# Altium project dev-board-boost.PrjPcb
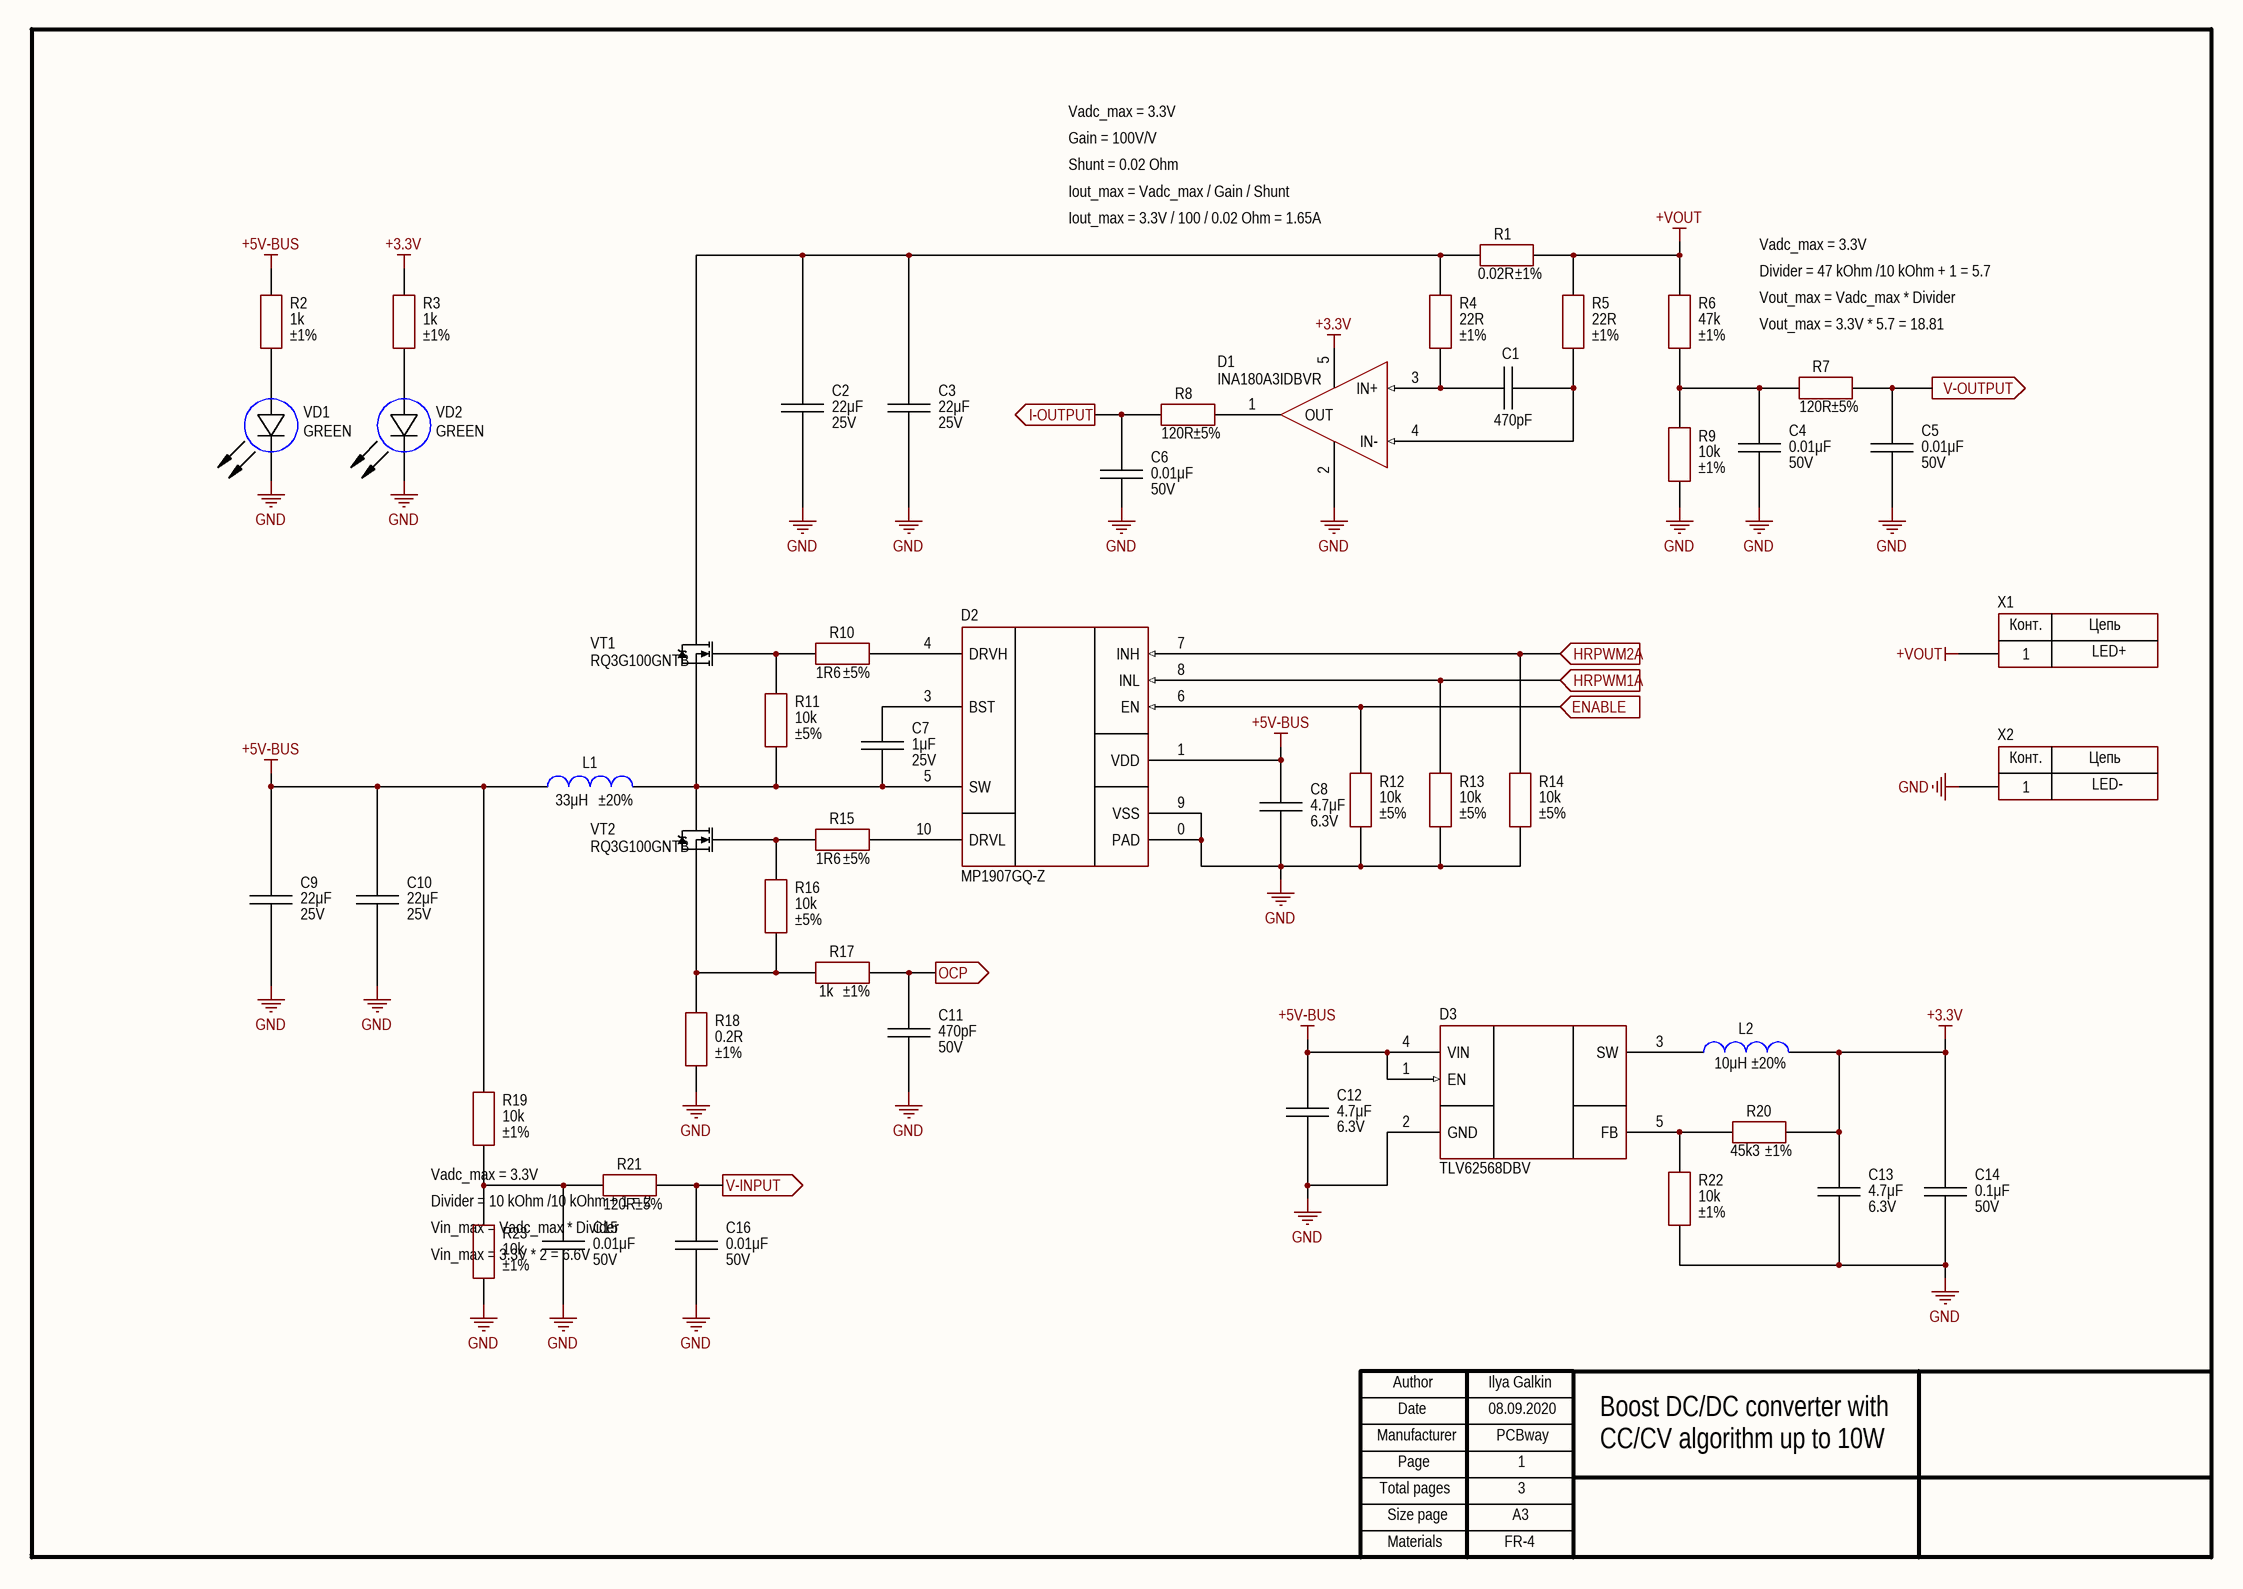
[diagram p0: converter.SchDoc]
3 sheets, 108 parts. Net scope: global (net labels, ports and power ports of the same name join across sheets).
Board file: pcb.PcbDoc
Sheets:
  converter.SchDoc
  dsp.SchDoc
  usb.SchDoc

## Sheet converter.SchDoc
size 420 x 297 mm; Address1: Address1; Address2: Address2; Address3: Address3; Address4: Address4; DocumentNumber: АБВГ.123456.001 Э3; SheetNumber: 1; SheetTotal: 3; Scale: 1:1; DocumentType: Схема электрическая принципиальная; FirstReferrence: АБВГ.123456.001

### Parts
C1  value 470pF  [CAP: 0603]
C2  value 22μF  Voltage: 25V  [CAP: 1210]
C3  value 22μF  Voltage: 25V  [CAP: 1210]
C4  value 0.01μF  Voltage: 50V  [CAP: 0603]
C5  value 0.01μF  Voltage: 50V  [CAP: 0603]
C6  value 0.01μF  Voltage: 50V  [CAP: 0603]
C7  value 1μF  Voltage: 25V  [CAP: 0603]
C8  value 4.7μF  Voltage: 6.3V  [CAP: 0603]
C9  value 22μF  Voltage: 25V  [CAP: 1210]
C10  value 22μF  Voltage: 25V  [CAP: 1210]
C11  value 470pF  Voltage: 50V  [CAP: 0603]
C12  value 4.7μF  Voltage: 6.3V  [CAP: 0603]
C13  value 4.7μF  Voltage: 6.3V  [CAP: 0603]
C14  value 0.1μF  Voltage: 50V  [CAP: 0603]
C15  value 0.01μF  Voltage: 50V  [CAP: 0603]
C16  value 0.01μF  Voltage: 50V  [CAP: 0603]
D1  (no value)  [SOT23-5]
D2  (no value)  [10-DFN]
D3  (no value)  [SOT23-5]
L1  value 33μH  Tolerance: ±20%  [IND: SRP1038C]
L2  value 10μH  Tolerance: ±20%  [IND: CD32]
R1  value 0.02R  Tolerance: ±1%  [RES: 1206]
R2  value 1k  Tolerance: ±1%  [RES: 0603]
R3  value 1k  Tolerance: ±1%  [RES: 0603]
R4  value 22R  Tolerance: ±1%  [RES: 0603]
R5  value 22R  Tolerance: ±1%  [RES: 0603]
R6  value 47k  Tolerance: ±1%  [RES: 0603]
R7  value 120R  Tolerance: ±5%  [RES: 0603]
R8  value 120R  Tolerance: ±5%  [RES: 0603]
R9  value 10k  Tolerance: ±1%  [RES: 0603]
R10  value 1R6  Tolerance: ±5%  [RES: 0603]
R11  value 10k  Tolerance: ±5%  [RES: 0603]
R12  value 10k  Tolerance: ±5%  [RES: 0603]
R13  value 10k  Tolerance: ±5%  [RES: 0603]
R14  value 10k  Tolerance: ±5%  [RES: 0603]
R15  value 1R6  Tolerance: ±5%  [RES: 0603]
R16  value 10k  Tolerance: ±5%  [RES: 0603]
R17  value 1k  Tolerance: ±1%  [RES: 0603]
R18  value 0.2R  Tolerance: ±1%  [RES: 1210]
R19  value 10k  Tolerance: ±1%  [RES: 0603]
R20  value 45k3  Tolerance: ±1%  [RES: 0603]
R21  value 120R  Tolerance: ±5%  [RES: 0603]
R22  value 10k  Tolerance: ±1%  [RES: 0603]
R23  value 10k  Tolerance: ±1%  [RES: 0603]
VD1  Color: GREEN  [LED: 0603G]
VD2  Color: GREEN  [LED: 0603G]
VT1  PartNumber: RQ3G100GNTB  [8-PowerWDFN]
VT2  PartNumber: RQ3G100GNTB  [8-PowerWDFN]
X1  (no value)  [CON: TH 1mm]
X2  (no value)  [CON: TH 1mm]

### Ports
ENABLE (in), HRPWM1A (in), HRPWM2A (in), I-OUTPUT (out), OCP (out), V-INPUT (out), V-OUTPUT (out)

### Nets
+3.3V: C13.2 C14.2 D1.5(V+) L2.1 R3.2 R20.1
+5V-BUS: C8.2 C9.2 C10.2 C12.2 D2.1(VDD) D3.1(EN) D3.4(VIN) L1.2 R2.2 R19.2
+VOUT: R1.2 R5.2 R6.1 X1.1
GND: C2.1 C3.1 C4.1 C5.1 C6.1 C8.1 C9.1 C10.1 C11.2 C12.1 C13.1 C14.1 C15.1 C16.1 D1.2(V-) D2.0(PAD) D2.9(VSS) D3.2(GND) R9.1 R12.1 R13.1 R14.1 R18.1 R22.1 R23.1 VD1.2(C) VD2.2(C) X2.1
NetC1_1: C1.1 D1.4(IN-) R5.1
NetC1_2: C1.2 D1.3(IN+) R4.1
NetC2_2: C2.2 C3.2 R1.1 R4.2 VT1.2(D)
NetC4_2: C4.2 R6.2 R7.1 R9.2
NetC5_2: C5.2 R7.2 ; port V-OUTPUT
NetC6_2: C6.2 R8.1 ; port I-OUTPUT
NetC7_1: C7.1 D2.5(SW) L1.1 R11.1 VT1.3(S) VT2.2(D)
NetC7_2: C7.2 D2.3(BST)
NetC11_1: C11.1 R17.2 ; port OCP
NetC15_2: C15.2 R19.1 R21.1 R23.2
NetC16_2: C16.2 R21.2 ; port V-INPUT
NetD1_1: D1.1(OUT) R8.2
NetD2_4: D2.4(DRVH) R10.2
NetD2_6: D2.6(EN) R12.2 ; port ENABLE
NetD2_7: D2.7(INH) R14.2 ; port HRPWM2A
NetD2_8: D2.8(INL) R13.2 ; port HRPWM1A
NetD2_10: D2.10(DRVL) R15.2
NetD3_3: D3.3(SW) L2.2
NetD3_5: D3.5(FB) R20.2 R22.2
NetR2_1: R2.1 VD1.1(A)
NetR3_1: R3.1 VD2.1(A)
NetR10_1: R10.1 R11.2 VT1.1(G)
NetR15_1: R15.1 R16.2 VT2.1(G)
NetR16_1: R16.1 R17.1 R18.2 VT2.3(S)

### Notes on the sheet
- Vadc_max = 3.3V
- Gain = 100V/V
- Shunt = 0.02 Ohm
- Iout_max = Vadc_max / Gain / Shunt
- Iout_max = 3.3V / 100 / 0.02 Ohm = 1.65A
- Divider = 47 kOhm /10 kOhm + 1 = 5.7
- Vout_max = Vadc_max * Divider
- Vout_max = 3.3V * 5.7 = 18.81
- LED+
- LED-
- Divider = 10 kOhm /10 kOhm + 1 = 2
- (near R23) Vin_max = Vadc_max * Divider
- (near R23) Vin_max = 3.3V * 2 = 6.6V
- Ilya Galkin
- 08.09.2020
- PCBway
- 1
- Boost DC/DC converter with
- CC/CV algorithm up to 10W
- 3
- FR-4
- Author
- Manufacturer
- Date
- Page
- Total pages
- Size page
- A3
- Materials
- (in symbol Connector_single_power) Конт.; Цепь

### Library data of the parts
C1 = Ceramic_0603: Manufacturer: Yageo; PartNumber: CL10C471JB8NNNC; ValueManufacturerPartNumber: Ceramic capacitor, 470pF, NPO, ±5%, 50V, 0603, -55...+125°C; TypeCapacitor: Ceramic capacitor; Tolerance: ±5%; TypeDielectric: NPO; Voltage: 50V; Package: 0603; HelpURL: https://www.digikey.com/product-detail/en/samsung-electro-mechanics/CL10C471JB8NNNC/1276-1168-1-ND/3889254; Temperature: -55...+125°C
C2 C3 C9 C10 = Ceramic_1210: Manufacturer: Samsung; PartNumber: CL32B226KAJNNNE; ValueManufacturerPartNumber: Ceramic capacitor, 22μF, X7R, ±10%, 25V, 1210, -55...+125°C; TypeCapacitor: Ceramic capacitor; Tolerance: ±10%; TypeDielectric: X7R; Package: 1210; HelpURL: https://www.digikey.com/product-detail/en/samsung-electro-mechanics/CL32B226KAJNNNE/1276-3392-1-ND/3891478; Temperature: -55...+125°C
C4-C6 C15 C16 = Ceramic_0603: Manufacturer: Samsung; PartNumber: CL10B103KB8NNNC; ValueManufacturerPartNumber: Ceramic capacitor, 0.01μF, X7R, ±10%, 50V, 0603, -55...+125°C; TypeCapacitor: Ceramic capacitor; Tolerance: ±10%; TypeDielectric: X7R; Package: 0603; HelpURL: https://www.digikey.com/product-detail/en/samsung-electro-mechanics/CL10B103KB8NNNC/1276-1009-1-ND/3889095; Temperature: -55...+125°C
C7 = Ceramic_0603: Manufacturer: Samsung; PartNumber: CL10B105KA8NNNC; ValueManufacturerPartNumber: Ceramic capacitor, 1μF, X7R, ±10%, 25V, 0603, -55...+125°C; TypeCapacitor: Ceramic capacitor; Tolerance: ±10%; TypeDielectric: X7R; Package: 0603; HelpURL: https://www.digikey.com/product-detail/en/samsung-electro-mechanics/CL10B105KA8NNNC/1276-1184-1-ND/3889270; Temperature: -55...+125°C
C8 C12 C13 = Ceramic_0603: Manufacturer: Samsung; PartNumber: CL10B475KQ8NQNC; ValueManufacturerPartNumber: Ceramic capacitor, 4.7μF, X7R, ±10%, 6.3V, 0603, -55...+125°C; TypeCapacitor: Ceramic capacitor; Tolerance: ±10%; TypeDielectric: X7R; Package: 0603; HelpURL: https://www.digikey.com/product-detail/en/samsung-electro-mechanics/CL10B475KQ8NQNC/1276-2087-6-ND/3892601; Temperature: -55...+125°C
C11 = Ceramic_0603: Manufacturer: Yageo; PartNumber: CL10C471JB8NNNC; ValueManufacturerPartNumber: Ceramic capacitor, 470pF, NPO, ±5%, 50V, 0603, -55...+125°C; TypeCapacitor: Ceramic capacitor; Tolerance: ±5%; TypeDielectric: NPO; Package: 0603; HelpURL: https://www.digikey.com/product-detail/en/samsung-electro-mechanics/CL10C471JB8NNNC/1276-1168-1-ND/3889254; Temperature: -55...+125°C
C14 = Ceramic_0603: Manufacturer: Samsung; PartNumber: CL10B104KB8NNNL; ValueManufacturerPartNumber: Ceramic capacitor, 0.1μF, X7R, ±10%, 50V, 0603, -55...+125°C; TypeCapacitor: Ceramic capacitor; Tolerance: ±10%; TypeDielectric: X7R; Package: 0603; HelpURL: https://www.digikey.com/product-detail/en/samsung-electro-mechanics/CL10B104KB8NNNL/1276-CL10B104KB8NNNLCT-ND/10320686; Temperature: -55...+125°C
D1 = INA180A3IDBVR: Current monitor; Manufacturer: Texas Instruments; ValueManufacturerPartNumber: IC current monitor, ±1.5%, 100V/V, -0.3...+26V, -40...+125°C, SOT23-5; Supply: -0.3...+26V; Accuracy: ±1.5%; GainBandwidth: 100V/V; HelpURL: https://www.digikey.com/product-detail/en/texas-instruments/INA180A3IDBVR/296-47654-1-ND/8133023; Package: SOT23-5; ComponentType: IC current monitor; Temperature: -40...+125°C; PartNumber: INA180A3IDBVR
D2 = MP1907GQ-Z: Gate driver; Manufacturer: Monolithic Power Systems; ValueManufacturerPartNumber: Half-bridge gate driver, 100V, 500kHz, ±2.5A, supply 4.5...18V, -40...+125°C, 10-VFDFN (3x3); VoltageSupply: supply 4.5...18V; Frequency: 500kHz; CurrentOutput: ±2.5A; VoltageWork: 100V; HelpURL: https://www.digikey.com/product-detail/en/monolithic-power-systems-inc/MP1907GQ-Z/1589-1544-1-ND/9433310; Package: 10-VFDFN (3x3); ComponentType: Half-bridge gate driver; Temperature: -40...+125°C; PartNumber: MP1907GQ-Z
D3 = TLV62568DBV: Buck converter; Manufacturer: Texas Instruments; ValueManufacturerPartNumber: DC/DC buck converter, input 2.5...5.5V, 1.5MHz, output 0.6V, 1A, -40...+85°C, SOT23-5; VoltageInput: input 2.5...5.5V; Frequency: 1.5MHz; CurrentOutput: 1A; VoltageOutput: output 0.6V; HelpURL: https://www.digikey.com/product-detail/en/texas-instruments/TLV62568DBVT/296-47387-1-ND/7688580; Package: SOT23-5; ComponentType: DC/DC buck converter; Temperature: -40...+85°C; PartNumber: TLV62568DBV
L1 = Inductor_SRP1038C: Manufacturer: Bourns; PartNumber: SRP1038C-330M; ValueManufacturerPartNumber: Fixed inductor, 33μH, ±20%, SRP1038C series, 4A, -40...+125°C; TypeInductor: Fixed inductor; MaxCurrent: 4A; Package: SRP1038C series; HelpURL: https://www.digikey.com/product-detail/en/bourns-inc/SRP1038C-330M/SRP1038C-330MCT-ND/10249152; Temperature: -40...+125°C
L2 = Inductor_CD32: Manufacturer: Codaca; PartNumber: SDR0302-100ML; ValueManufacturerPartNumber: Fixed inductor, 10μH, ±20%, SP32 series, 900mA, -40...+125°C; TypeInductor: Fixed inductor; MaxCurrent: 900mA; Package: SP32 series; HelpURL: https://www.digikey.com/product-detail/en/bourns-inc/SDR0302-100ML/SDR0302-100MLCT-ND/2127048; Temperature: -40...+125°C
R1 = Resistor_1206: Manufacturer: Yageo; PartNumber: PF1206FRF070R02L; ValueManufacturerPartNumber: Resistor film, 0.02R, ±1%, 1206, 0.25W, -55...+125°C; TypeResistor: Resistor film; Power: 0.25W; Package: 1206; HelpURL: https://www.digikey.com/product-detail/en/yageo/PF1206FRF070R02L/311-0-02AJCT-ND/2178365; Temperature: -55...+125°C
R2 R3 R17 = Resistor_0603: Manufacturer: Yageo; PartNumber: RC0603FR-071KL; ValueManufacturerPartNumber: Resistor film, 1k, ±1%, 0603, 0.1W, -55...+125°C; TypeResistor: Resistor film; Power: 0.1W; Package: 0603; HelpURL: https://www.digikey.com/product-detail/en/yageo/RC0603FR-071KL/311-1-00KHRCT-ND/729790; Temperature: -55...+125°C
R4 R5 = Resistor_0603: Manufacturer: Yageo; PartNumber: RC0603FR-0722RL; ValueManufacturerPartNumber: Resistor film, 22R, ±1%, 0603, 0.1W, -55...+125°C; TypeResistor: Resistor film; Power: 0.1W; Package: 0603; HelpURL: https://www.digikey.com/product-detail/en/yageo/RC0603FR-0722RL/311-22-0HRCT-ND/730002; Temperature: -55...+125°C
R6 = Resistor_0603: Manufacturer: Yageo; PartNumber: RC0603FR-0747KL; ValueManufacturerPartNumber: Resistor film, 47k, ±1%, 0603, 0.1W, -55...+125°C; TypeResistor: Resistor film; Power: 0.1W; Package: 0603; HelpURL: https://www.digikey.com/product-detail/en/yageo/RC0603FR-0747KL/311-47-0KHRCT-ND/730200; Temperature: -55...+125°C
R7 R8 R21 = Resistor_0603: Manufacturer: Yageo; PartNumber: RC0603JR-07120RL; ValueManufacturerPartNumber: Resistor film, 120R, ±5%, 0603, 0.1W, -55...+125°C; TypeResistor: Resistor film; Power: 0.1W; Package: 0603; HelpURL: https://www.digikey.com/product-detail/en/yageo/RC0603JR-07120RL/311-120GRCT-ND/729653; Temperature: -55...+125°C
R9 R19 R22 R23 = Resistor_0603: Manufacturer: Yageo; PartNumber: RC0603FR-0710KL; ValueManufacturerPartNumber: Resistor film, 10k, ±1%, 0603, 0.1W, -55...+125°C; TypeResistor: Resistor film; Power: 0.1W; Package: 0603; HelpURL: https://www.digikey.com/product-detail/en/yageo/RC0603FR-0710KL/311-10-0KHRCT-ND/729827; Temperature: -55...+125°C
R10 R15 = Resistor_0603: Manufacturer: Yageo; PartNumber: RC0603JR-071R6L; ValueManufacturerPartNumber: Resistor film, 1R6, ±5%, 0603, 0.1W, -55...+125°C; TypeResistor: Resistor film; Power: 0.1W; Package: 0603; HelpURL: https://www.digikey.com/product-detail/en/yageo/RC0603JR-071R6L/311-1-6GRCT-ND/729638; Temperature: -55...+125°C
R11-R14 R16 = Resistor_0603: Manufacturer: Yageo; PartNumber: RC0603JR-0710KL; ValueManufacturerPartNumber: Resistor film, 10k, ±5%, 0603, 0.1W, -55...+125°C; TypeResistor: Resistor film; Power: 0.1W; Package: 0603; HelpURL: https://www.digikey.com/product-detail/en/yageo/RC0603JR-0710KL/311-10KGRCT-ND/729647; Temperature: -55...+125°C
R18 = Resistor_1210: Manufacturer: Yageo; PartNumber: RL1210FR-070R2L; ValueManufacturerPartNumber: Resistor film, 0.2R, ±1%, 1210, 0.5W, -55...+125°C; TypeResistor: Resistor film; Power: 0.5W; Package: 1210; HelpURL: https://www.digikey.com/product-detail/en/yageo/RL1210FR-070R2L/311-0-2NACT-ND/3886121; Temperature: -55...+125°C
R20 = Resistor_0603: Manufacturer: Yageo; PartNumber: RC0603FR-0745K3L; ValueManufacturerPartNumber: Resistor film, 45k3, ±1%, 0603, 0.1W, -55...+125°C; TypeResistor: Resistor film; Power: 0.1W; Package: 0603; HelpURL: https://www.digikey.com/product-detail/en/yageo/RC0603FR-0745K3L/311-45-3KHRCT-ND/730192; Temperature: -55...+125°C
VD1 VD2 = LED_single: Manufacturer: Wurth; ValueManufacturerPartNumber: LED, 20mA, 2V, 0603, -55...+150°C; PartNumber: 150060VS75000; TypeDiode: LED; Current: 20mA; VoltageDrop: 2V; Package: 0603; HelpURL: https://www.digikey.com/product-detail/en/w-rth-elektronik/150060VS75000/732-4980-1-ND/4489904; Temperature: -55...+150°C
VT1 VT2 = MOSFET_N_123: Manufacturer: Rohm Semiconductor; ValueManufacturerPartNumber: MOSFET N-channel transistor, 40V, 10A, 8.4nC, 2W, 14.3mOhm, 615pF, 8-PowerVDFN (3x3), -55...+150°C; TypeTransistor: MOSFET N-channel transistor; VoltageDS: 40V; CurrentDS: 10A; RDS: 14.3mOhm; GateCharge: 8.4nC; InputCapacitor: 615pF; MaxPower: 2W; Package: 8-PowerVDFN (3x3); HelpURL: https://www.digikey.com/product-detail/en/rohm-semiconductor/RQ3G100GNTB/RQ3G100GNTBCT-ND/5042551; Temperature: -55...+150°C
X1 X2 = Connector_single_power: ValueManufacturerPartNumber: Power connector, *, *; TypeConnector: Power connector; CommentText: "Разъем"; Manufacturer: *; HelpURL: *; PartNumber: *; VoltageMax: *; CurrentMax: *

## Sheet dsp.SchDoc
size 420 x 297 mm; Address1: Address1; Address2: Address2; Address3: Address3; Address4: Address4; DocumentNumber: АБВГ.123456.001 Э3; SheetNumber: 2; SheetTotal: 3; Scale: 1:1; DocumentType: Схема электрическая принципиальная; FirstReferrence: АБВГ.123456.001
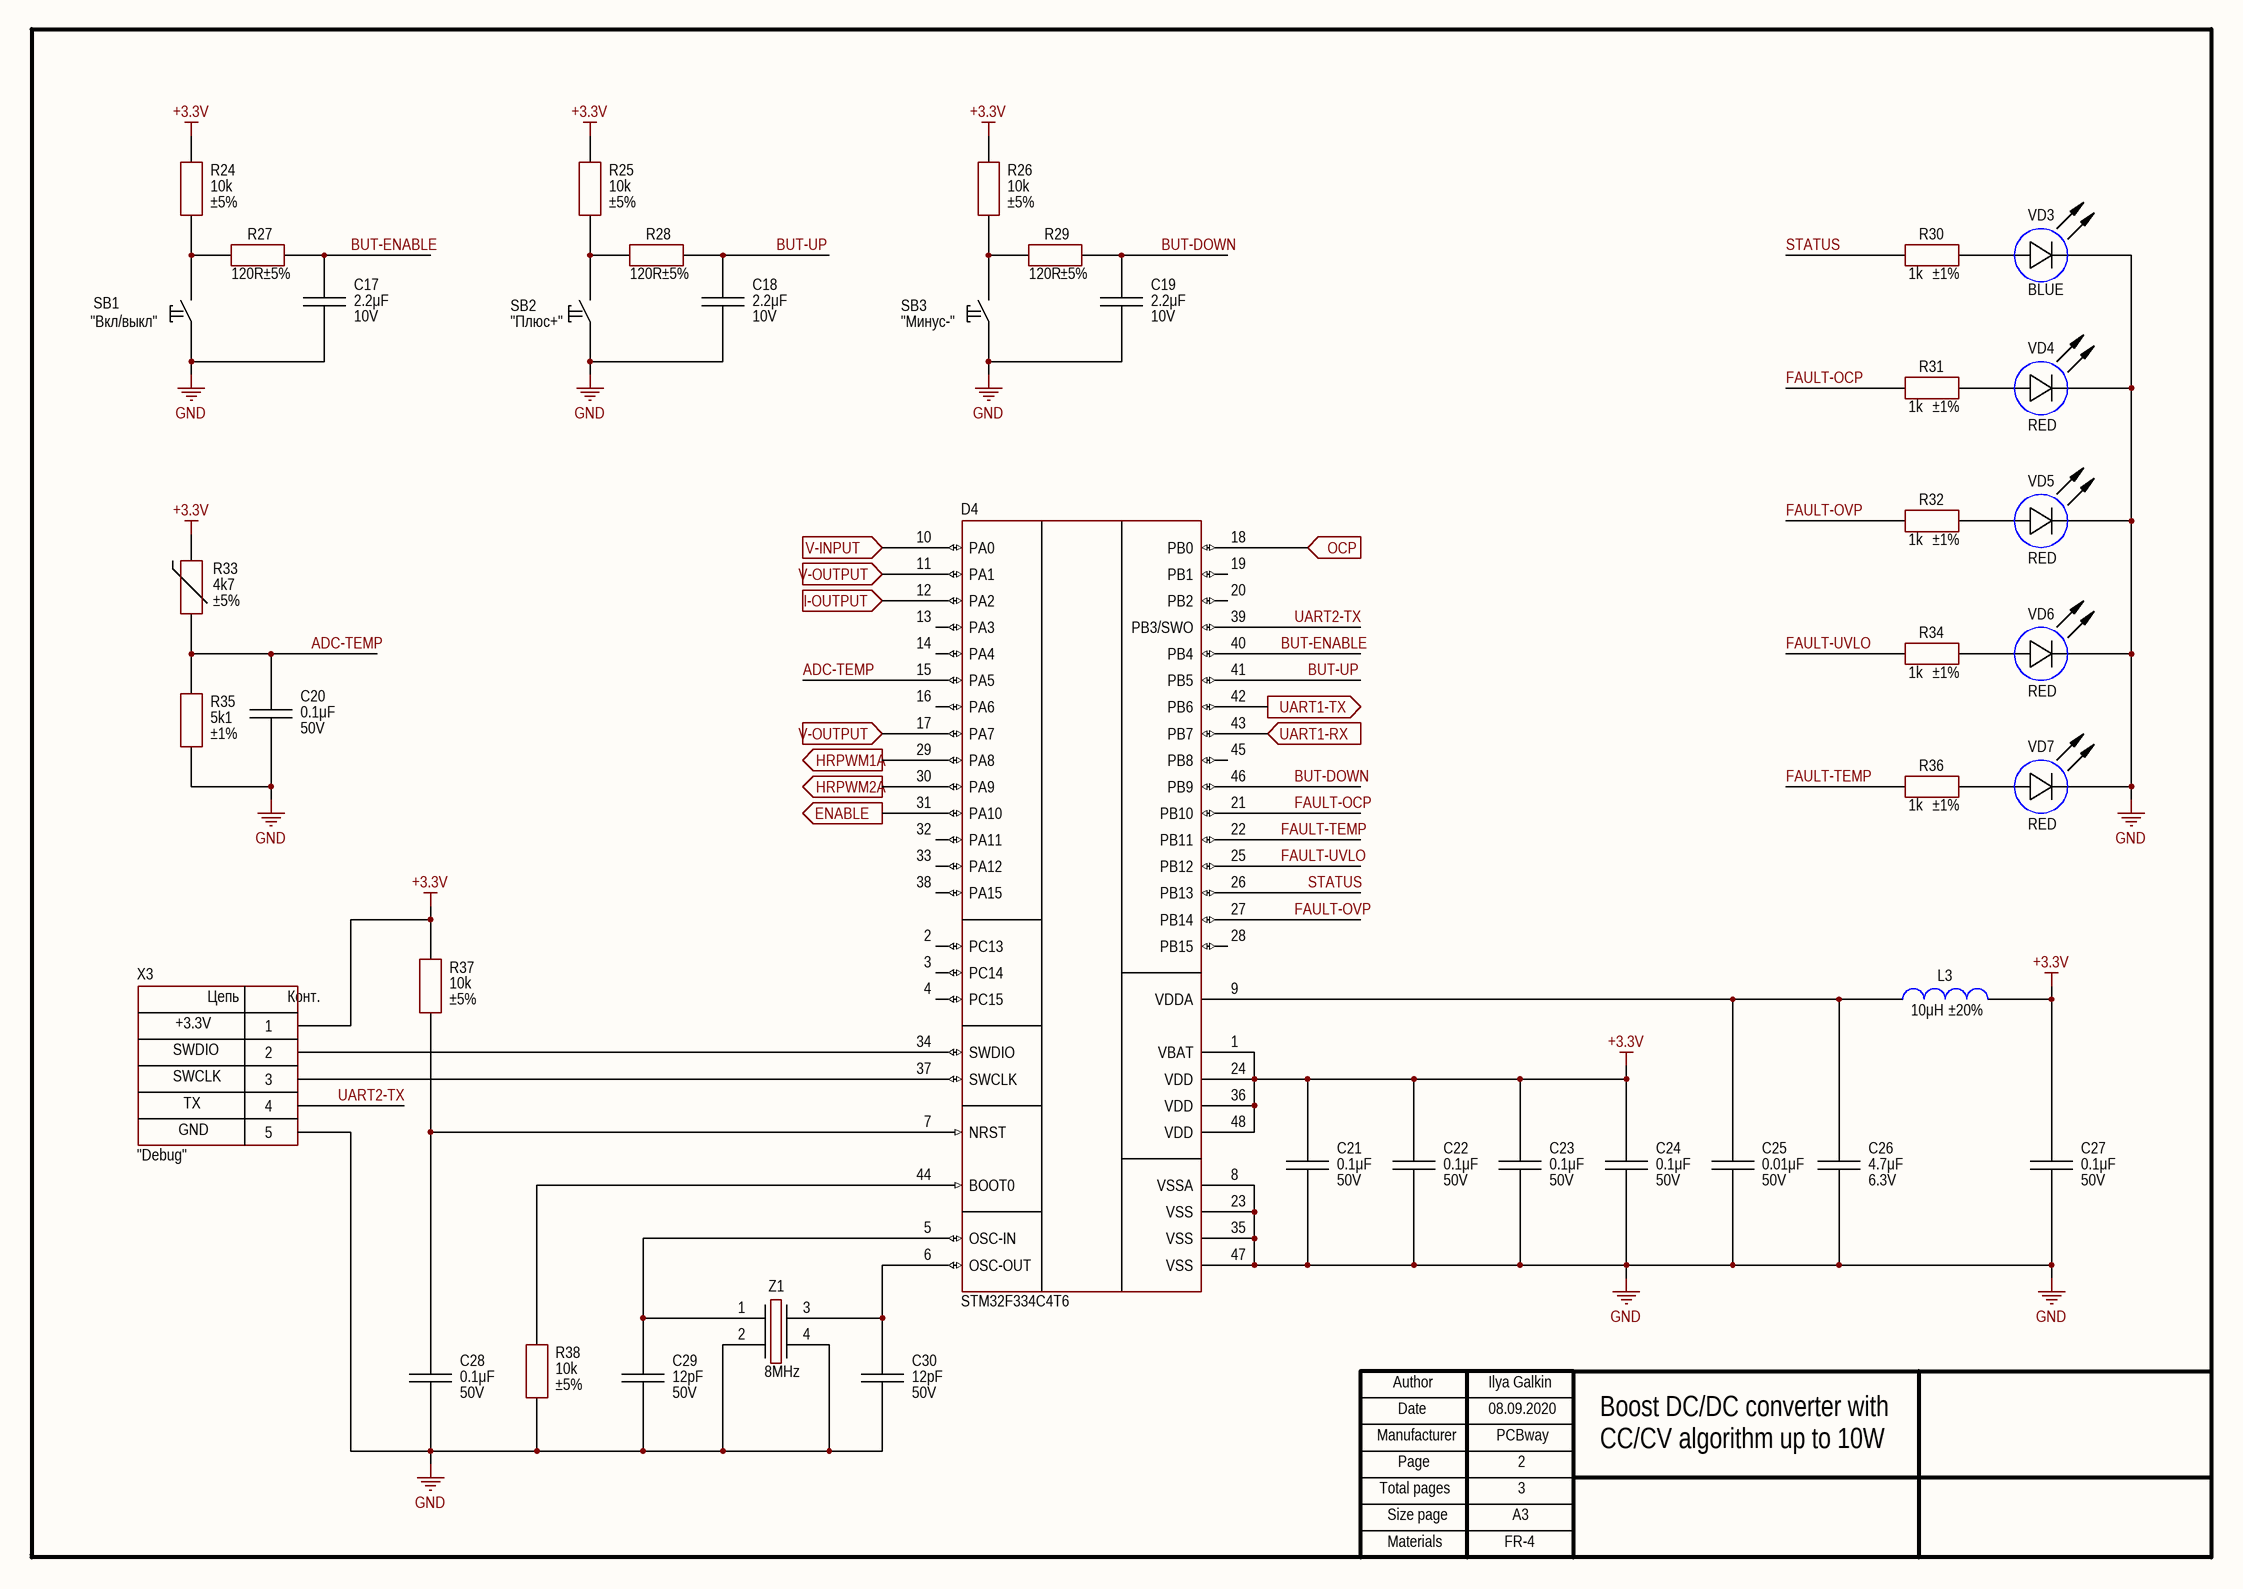
[diagram p1: dsp.SchDoc]

### Parts
C17  value 2.2μF  Voltage: 10V  [CAP: 0603]
C18  value 2.2μF  Voltage: 10V  [CAP: 0603]
C19  value 2.2μF  Voltage: 10V  [CAP: 0603]
C20  value 0.1μF  Voltage: 50V  [CAP: 0603]
C21  value 0.1μF  Voltage: 50V  [CAP: 0603]
C22  value 0.1μF  Voltage: 50V  [CAP: 0603]
C23  value 0.1μF  Voltage: 50V  [CAP: 0603]
C24  value 0.1μF  Voltage: 50V  [CAP: 0603]
C25  value 0.01μF  Voltage: 50V  [CAP: 0603]
C26  value 4.7μF  Voltage: 6.3V  [CAP: 0603]
C27  value 0.1μF  Voltage: 50V  [CAP: 0603]
C28  value 0.1μF  Voltage: 50V  [CAP: 0603]
C29  value 12pF  Voltage: 50V  [CAP: 0603]
C30  value 12pF  Voltage: 50V  [CAP: 0603]
D4  PartNumber: STM32F334C4T6  [48-LQFP]
L3  value 10μH  Tolerance: ±20%  [IND: 0603]
R24  value 10k  Tolerance: ±5%  [RES: 0603]
R25  value 10k  Tolerance: ±5%  [RES: 0603]
R26  value 10k  Tolerance: ±5%  [RES: 0603]
R27  value 120R  Tolerance: ±5%  [RES: 0603]
R28  value 120R  Tolerance: ±5%  [RES: 0603]
R29  value 120R  Tolerance: ±5%  [RES: 0603]
R30  value 1k  Tolerance: ±1%  [RES: 0603]
R31  value 1k  Tolerance: ±1%  [RES: 0603]
R32  value 1k  Tolerance: ±1%  [RES: 0603]
R33  value 4k7  Tolerance: ±5%  [RES: 0603]
R34  value 1k  Tolerance: ±1%  [RES: 0603]
R35  value 5k1  Tolerance: ±1%  [RES: 0603]
R36  value 1k  Tolerance: ±1%  [RES: 0603]
R37  value 10k  Tolerance: ±5%  [RES: 0603]
R38  value 10k  Tolerance: ±5%  [RES: 0603]
SB1  CommentText: "Вкл/выкл"  [BUT: 6x3.5 SMD]
SB2  CommentText: "Плюс+"  [BUT: 6x3.5 SMD]
SB3  CommentText: "Минус-"  [BUT: 6x3.5 SMD]
VD3  Color: BLUE  [LED: 0603B]
VD4  Color: RED  [LED: 0603R]
VD5  Color: RED  [LED: 0603R]
VD6  Color: RED  [LED: 0603R]
VD7  Color: RED  [LED: 0603R]
X3  CommentText: "Debug"  [CON: SM05B-GHS]
Z1  Frequency: 8MHz  [OSC: 3225]

### Ports
ENABLE (out), HRPWM1A (out), HRPWM2A (out), I-OUTPUT (in), OCP (in), UART1-RX (in), UART1-TX (out), V-INPUT (in), V-OUTPUT (in)

### Nets
+3.3V: C21.2 C22.2 C23.2 C24.2 C27.2 D4.1(VBAT) D4.24(VDD) D4.36(VDD) D4.48(VDD) L3.1 R24.2 R25.2 R26.2 R33.2 R37.2 X3.1
GND: C17.1 C18.1 C19.1 C20.1 C21.1 C22.1 C23.1 C24.1 C25.1 C26.1 C27.1 C28.1 C29.1 C30.1 D4.8(VSSA) D4.23(VSS) D4.35(VSS) D4.47(VSS) R35.1 R38.1 SB1.1 SB2.1 SB3.1 VD3.2(C) VD4.2(C) VD5.2(C) VD6.2(C) VD7.2(C) X3.5 Z1.2 Z1.4
ADC-TEMP: C20.2 D4.15(PA5) R33.1 R35.2
BUT-DOWN: C19.2 D4.46(PB9) R29.2
BUT-ENABLE: C17.2 D4.40(PB4) R27.2
BUT-UP: C18.2 D4.41(PB5) R28.2
FAULT-OCP: D4.21(PB10) R31.1
FAULT-OVP: D4.27(PB14) R32.1
FAULT-TEMP: D4.22(PB11) R36.1
FAULT-UVLO: D4.25(PB12) R34.1
STATUS: D4.26(PB13) R30.1
UART2-TX: D4.39(PB3/SWO) X3.4
NetC5_2: D4.11(PA1) D4.17(PA7) ; port V-OUTPUT
NetC6_2: D4.12(PA2) ; port I-OUTPUT
NetC11_1: D4.18(PB0) ; port OCP
NetC16_2: D4.10(PA0) ; port V-INPUT
NetC25_2: C25.2 C26.2 D4.9(VDDA) L3.2
NetC28_2: C28.2 D4.7(NRST) R37.1
NetC29_2: C29.2 D4.5(OSC-IN) Z1.1
NetC30_2: C30.2 D4.6(OSC-OUT) Z1.3
NetD2_6: D4.31(PA10) ; port ENABLE
NetD2_7: D4.30(PA9) ; port HRPWM2A
NetD2_8: D4.29(PA8) ; port HRPWM1A
NetD4_34: D4.34(SWDIO) X3.2
NetD4_37: D4.37(SWCLK) X3.3
NetD4_42: D4.42(PB6) ; port UART1-TX
NetD4_43: D4.43(PB7) ; port UART1-RX
NetD4_44: D4.44(BOOT0) R38.2
NetR24_1: R24.1 R27.1 SB1.2
NetR25_1: R25.1 R28.1 SB2.2
NetR26_1: R26.1 R29.1 SB3.2
NetR30_2: R30.2 VD3.1(A)
NetR31_2: R31.2 VD4.1(A)
NetR32_2: R32.2 VD5.1(A)
NetR34_2: R34.2 VD6.1(A)
NetR36_2: R36.2 VD7.1(A)

Not connected (* = marked no-connect by the designer): D4 2(PC13) 3(PC14) 4(PC15) 13(PA3) 14(PA4) 16(PA6) 19(PB1) 20(PB2) 28(PB15) 32(PA11) 33(PA12) 38(PA15) 45(PB8)

### Notes on the sheet
- SWDIO
- +3.3V
- SWCLK
- GND
- TX
- Ilya Galkin
- 08.09.2020
- PCBway
- 2
- Boost DC/DC converter with
- CC/CV algorithm up to 10W
- 3
- FR-4
- Author
- Manufacturer
- Date
- Page
- Total pages
- Size page
- A3
- Materials
- (in symbol Connector_SM05B) Цепь; Конт.

### Library data of the parts
C17-C19 = Ceramic_0603: Manufacturer: Samsung; PartNumber: CL10B225KP8NFNC; ValueManufacturerPartNumber: Ceramic capacitor, 2.2μF, X7R, ±10%, 10V, 0603, -55...+125°C; TypeCapacitor: Ceramic capacitor; Tolerance: ±10%; TypeDielectric: X7R; Package: 0603; HelpURL: https://www.digikey.com/product-detail/en/samsung-electro-mechanics/CL10B225KP8NFNC/1276-2016-1-ND/3890102; Temperature: -55...+125°C
C20-C24 C27 C28 = Ceramic_0603: as C14 on sheet converter; Package: 0603; HelpURL: https://www.digikey.com/product-detail/en/samsung-electro-mechanics/CL10B104KB8NNNL/1276-CL10B104KB8NNNLCT-ND/10320686; Temperature: -55...+125°C
C25 = Ceramic_0603: as C4 on sheet converter; Package: 0603; HelpURL: https://www.digikey.com/product-detail/en/samsung-electro-mechanics/CL10B103KB8NNNC/1276-1009-1-ND/3889095; Temperature: -55...+125°C
C26 = Ceramic_0603: as C8 on sheet converter; Package: 0603; HelpURL: https://www.digikey.com/product-detail/en/samsung-electro-mechanics/CL10B475KQ8NQNC/1276-2087-6-ND/3892601; Temperature: -55...+125°C
C29 C30 = Ceramic_0603: Manufacturer: Samsung; PartNumber: CL10C120JB8NNNC; ValueManufacturerPartNumber: Ceramic capacitor, 12pF, NPO, ±10%, 50V, 0603, -55...+125°C; TypeCapacitor: Ceramic capacitor; Tolerance: ±10%; TypeDielectric: NPO; Package: 0603; HelpURL: https://www.digikey.com/product-detail/en/samsung-electro-mechanics/CL10C120JB8NNNC/1276-1254-1-ND/3889340; Temperature: -55...+125°C
D4 = STM32F334C8T6: Cortex-M4; Manufacturer: STMicroelectronics; ValueManufacturerPartNumber: IC microcontroller, 32-Bit, Cortex-M4, 72MHz, 64KB, 12KB, 2...3.6V, -40...+85°C, 48-LQFP; Supply: 2...3.6V; Speed: 72MHz; CoreSize: 32-Bit; MemoryROM: 64KB; MemoryRAM: 12KB; HelpURL: https://www.digikey.com/en/products/detail/stmicroelectronics/STM32F334C4T6/4989170?s=N4IgTCBcDaIMoBUCyBmMAxFKAsBhbCAbCALoC%2BQA; Package: 48-LQFP; ComponentType: IC microcontroller; Temperature: -40...+85°C; CoreProcessor: Cortex-M4
L3 = Inductor_0603: Manufacturer: Murata Electronics; PartNumber: LQM18FN100M00D; ValueManufacturerPartNumber: Fixed inductor, 10μH, ±20%, 0603, 50mA, -55...+125°C; TypeInductor: Fixed inductor; MaxCurrent: 50mA; Package: 0603; HelpURL: https://www.digikey.com/product-detail/en/murata-electronics-north-america/LQM18FN100M00D/490-4025-1-ND/1016285; Temperature: -55...+125°C
R24-R26 R37 R38 = Resistor_0603: as R11 on sheet converter; Package: 0603; HelpURL: https://www.digikey.com/product-detail/en/yageo/RC0603JR-0710KL/311-10KGRCT-ND/729647; Temperature: -55...+125°C
R27-R29 = Resistor_0603: as R7 on sheet converter; Package: 0603; HelpURL: https://www.digikey.com/product-detail/en/yageo/RC0603JR-07120RL/311-120GRCT-ND/729653; Temperature: -55...+125°C
R30-R32 R34 R36 = Resistor_0603: as R2 on sheet converter; Package: 0603; HelpURL: https://www.digikey.com/product-detail/en/yageo/RC0603FR-071KL/311-1-00KHRCT-ND/729790; Temperature: -55...+125°C
R33 = NTC: Manufacturer: Murata; PartNumber: NCP18XM472J03RB; ValueManufacturerPartNumber: NTC resistor, 4k7, ±5%, 0603, 3500K, -55...+125°C; TypeResistor: NTC resistor; MaxCurrent: 3500K; Package: 0603; HelpURL: https://www.digikey.com/en/products/detail/murata-electronics/NCP18XM472J03RB/588460; Temperature: -55...+125°C
R35 = Resistor_0603: Manufacturer: Yageo; PartNumber: RC0603FR-075K1L; ValueManufacturerPartNumber: Resistor film, 5k1, ±1%, 0603, 0.1W, -55...+125°C; TypeResistor: Resistor film; Power: 0.1W; Package: 0603; HelpURL: https://www.digikey.com/product-detail/en/yageo/RC0603FR-075K1L/311-5-10KHRCT-ND/730215; Temperature: -55...+125°C
SB1-SB3 = Button_tactile: Manufacturer: C&K; ValueManufacturerPartNumber: Tactile button, 6x3.5mm; PartNumber: PTS636 SM43; TypeButton: Tactile button; HelpURL: https://www.digikey.com/product-detail/en/c-k/PTS636-SM43-SMTR-LFS/CKN12310-1-ND/10071745; Package: 6x3.5mm
VD3 = LED_single: Manufacturer: Wurth; ValueManufacturerPartNumber: LED, 20mA, 3.2V, 0603, -55...+150°C; PartNumber: 150060BS75000; TypeDiode: LED; Current: 20mA; VoltageDrop: 3.2V; Package: 0603; HelpURL: https://www.digikey.com/product-detail/en/w-rth-elektronik/150060BS75000/732-4966-1-ND/4489893; Temperature: -55...+150°C
VD4-VD7 = LED_single: Manufacturer: Wurth; ValueManufacturerPartNumber: LED, 20 mA, 2V, 0603, -55...+150°C; PartNumber: 150060RS75000; TypeDiode: LED; Current: 20 mA; VoltageDrop: 2V; Package: 0603; HelpURL: https://www.digikey.com/product-detail/en/w-rth-elektronik/150060RS75000/732-4978-1-ND/4489899; Temperature: -55...+150°C
X3 = Connector_SM05B: Manufacturer: JST; ValueManufacturerPartNumber: Connector, 5pin, 1.25mm, 50VDC, 1A; PartNumber: SM05B-GHS; VoltageMax: 50VDC; Pitch: 1.25mm; CurrentMax: 1A; Multichannel: 5pin; HelpURL: https://www.digikey.com/product-detail/en/jst-sales-america-inc/SM05B-GHS-TB-LF-SN/455-1567-1-ND/807835; TypeConnector: Connector
Z1 = Crystal_3225: Manufacturer: ECS; PartNumber: ECS-80-12-33-JGN-TR; ValueManufacturerPartNumber: Crystal, 8MHz, 12pF, ±30ppm, case 3225, -40...+85°C; LoadCapacitance: 12pF; Tolerance: ±30ppm; Package: case 3225; HelpURL: https://www.digikey.com/product-detail/en/ecs-inc/ECS-80-12-33-JGN-TR/50-ECS-80-12-33-JGN-CT-ND/10478769; Temperature: -40...+85°C; TypeOscilator: Crystal

## Sheet usb.SchDoc
size 420 x 297 mm; Address1: Address1; Address2: Address2; Address3: Address3; Address4: Address4; DocumentNumber: АБВГ.123456.001 Э3; SheetNumber: 3; SheetTotal: 3; Scale: 1:1; DocumentType: Схема электрическая принципиальная; FirstReferrence: АБВГ.123456.001
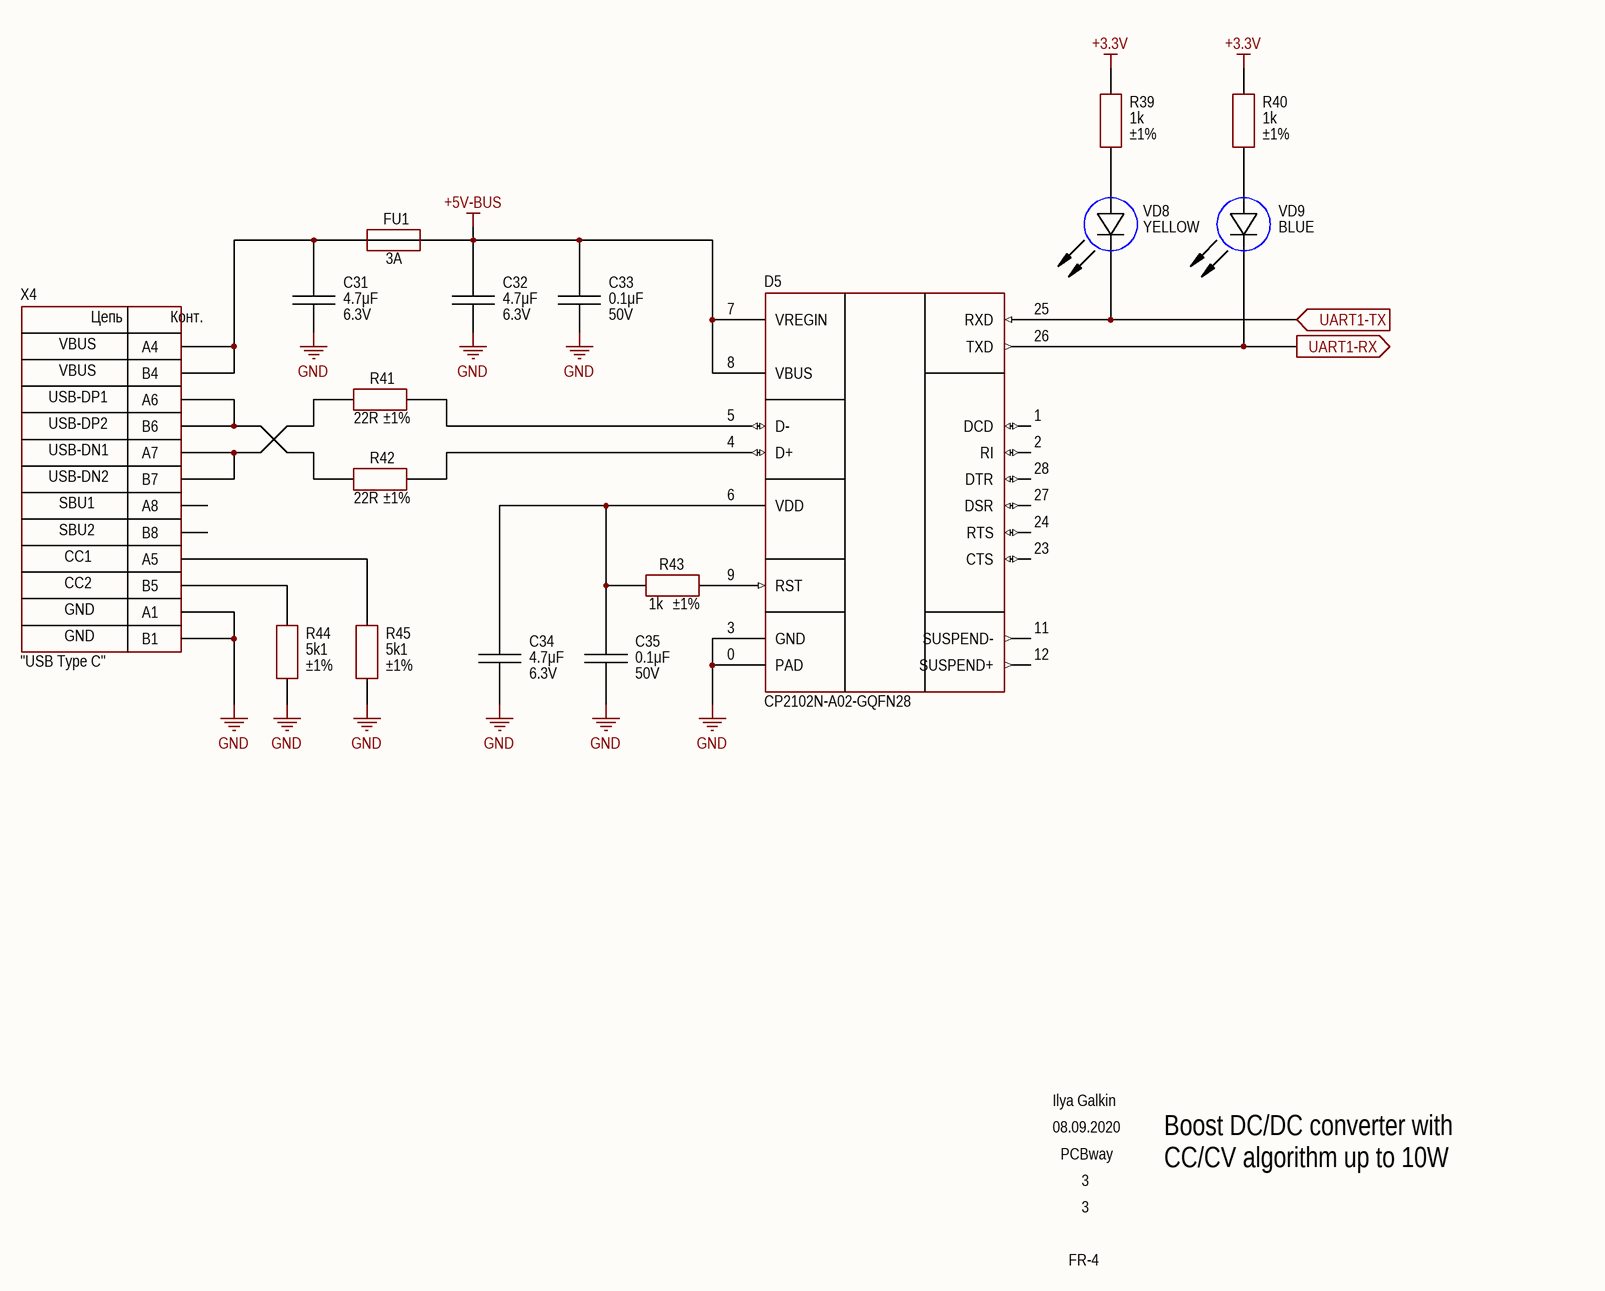
[diagram p2: usb.SchDoc]

### Parts
C31  value 4.7μF  Voltage: 6.3V  [CAP: 0603]
C32  value 4.7μF  Voltage: 6.3V  [CAP: 0603]
C33  value 0.1μF  Voltage: 50V  [CAP: 0603]
C34  value 4.7μF  Voltage: 6.3V  [CAP: 0603]
C35  value 0.1μF  Voltage: 50V  [CAP: 0603]
D5  PartNumber: CP2102N-A02-GQFN28  [28-QFN (5x5)]
FU1  MaxCurrent: 3A  [FUSE: 1206]
R39  value 1k  Tolerance: ±1%  [RES: 0603]
R40  value 1k  Tolerance: ±1%  [RES: 0603]
R41  value 22R  Tolerance: ±1%  [RES: 0603]
R42  value 22R  Tolerance: ±1%  [RES: 0603]
R43  value 1k  Tolerance: ±1%  [RES: 0603]
R44  value 5k1  Tolerance: ±1%  [RES: 0603]
R45  value 5k1  Tolerance: ±1%  [RES: 0603]
VD8  Color: YELLOW  [LED: 0603Y]
VD9  Color: BLUE  [LED: 0603B]
X4  CommentText: "USB Type C"  [CON: TYPE-C-31-M-12]

### Ports
UART1-RX (out), UART1-TX (in)

### Nets
+3.3V: R39.2 R40.2
+5V-BUS: C32.2 C33.2 D5.7(VREGIN) D5.8(VBUS) FU1.2
GND: C31.1 C32.1 C33.1 C34.1 C35.1 D5.0(PAD) D5.3(GND) R44.1 R45.1 X4.A1 X4.B1
NetC31_2: C31.2 FU1.1 X4.A4 X4.B4
NetC34_2: C34.2 C35.2 D5.6(VDD) R43.1
NetD4_42: D5.25(RXD) VD8.2(C) ; port UART1-TX
NetD4_43: D5.26(TXD) VD9.2(C) ; port UART1-RX
NetD5_4: D5.4(D+) R42.1
NetD5_5: D5.5(D-) R41.1
NetD5_9: D5.9(RST) R43.2
NetR39_1: R39.1 VD8.1(A)
NetR40_1: R40.1 VD9.1(A)
NetR41_2: R41.2 X4.A7 X4.B7
NetR42_2: R42.2 X4.A6 X4.B6
NetR44_2: R44.2 X4.B5
NetR45_2: R45.2 X4.A5

Not connected (* = marked no-connect by the designer): D5 1(DCD) 2(RI) 11(SUSPEND-) 12(SUSPEND+) 23(CTS) 24(RTS) 27(DSR) 28(DTR); X4 A8 B8

### Notes on the sheet
- Ilya Galkin
- 08.09.2020
- PCBway
- 3
- Boost DC/DC converter with
- CC/CV algorithm up to 10W
- FR-4
- Author
- Manufacturer
- Date
- Page
- Total pages
- Size page
- A3
- Materials
- (in symbol Connector_USB_Type_C) Цепь; Конт.; VBUS; USB-DP1; USB-DP2; USB-DN1; USB-DN2; SBU1; SBU2; CC1; CC2; GND

### Library data of the parts
C31 C32 C34 = Ceramic_0603: as C8 on sheet converter; Package: 0603; HelpURL: https://www.digikey.com/product-detail/en/samsung-electro-mechanics/CL10B475KQ8NQNC/1276-2087-6-ND/3892601; Temperature: -55...+125°C
C33 C35 = Ceramic_0603: as C14 on sheet converter; Package: 0603; HelpURL: https://www.digikey.com/product-detail/en/samsung-electro-mechanics/CL10B104KB8NNNL/1276-CL10B104KB8NNNLCT-ND/10320686; Temperature: -55...+125°C
D5 = CP2102N: USB-to-UART; Manufacturer: Silicon Labs; ValueManufacturerPartNumber: IC usb-to-uart bridge, USB2.0, 3...3.6V, -40...+85°C, 28-VFQFN; Supply: 3...3.6V; HelpURL: https://www.digikey.com/product-detail/en/silicon-labs/CP2102N-A02-GQFN28/336-5889-ND/9863477; Package: 28-VFQFN; ComponentType: IC usb-to-uart bridge; Temperature: -40...+85°C; Standard: USB2.0
FU1 = Fuse: Manufacturer: Panasonic; PartNumber: ERB-RG3R00V; TypeFuse: Electromechanics relay; VoltageMax: 32VDC; Package: 1206 case; HelpURL: https://www.digikey.com/product-detail/en/panasonic-electronic-components/ERB-RG3R00V/P16741CT-ND/4280098; ValueManufacturerPartNumber: =TypeFuse+', '+VoltageMax+', '+MaxCurrent+', '+Package+', '+Temperature
R39 R40 R43 = Resistor_0603: as R2 on sheet converter; Package: 0603; HelpURL: https://www.digikey.com/product-detail/en/yageo/RC0603FR-071KL/311-1-00KHRCT-ND/729790; Temperature: -55...+125°C
R41 R42 = Resistor_0603: as R4 on sheet converter; Package: 0603; HelpURL: https://www.digikey.com/product-detail/en/yageo/RC0603FR-0722RL/311-22-0HRCT-ND/730002; Temperature: -55...+125°C
R44 R45 = Resistor_0603: as R35 on sheet dsp; Package: 0603; HelpURL: https://www.digikey.com/product-detail/en/yageo/RC0603FR-075K1L/311-5-10KHRCT-ND/730215; Temperature: -55...+125°C
VD8 = LED_single: Manufacturer: Wurth; ValueManufacturerPartNumber: LED, 20mA, 2V, 0603, -55...+150°C; PartNumber: 150060YS75000; TypeDiode: LED; Current: 20mA; VoltageDrop: 2V; Package: 0603; HelpURL: https://www.digikey.com/product-detail/en/wurth-electronics-inc/150060YS75000/732-4981-1-ND/4489907; Temperature: -55...+150°C
VD9 = LED_single: as VD3 on sheet dsp; Package: 0603; HelpURL: https://www.digikey.com/product-detail/en/wurth-electronics-inc/150060BS75000/732-4966-1-ND/4489893; Temperature: -55...+150°C
X4 = Connector_USB_Type_C: Manufacturer: Korean Hroparts; ValueManufacturerPartNumber: USB Type C, 3A; PartNumber: TYPE-C-31-M-12; TypeConnector: USB Type C; CurrentMax: 3A; HelpURL: https://lcsc.com/product-detail/USB-Type-C_Korean-Hroparts-Elec-TYPE-C-31-M-12_C165948.html

## Nets that join several sheets
+3.3V: converter (6 pins), dsp (16 pins), usb (R39.2 R40.2)
+5V-BUS: converter (10 pins), usb (5 pins)
GND: converter (28 pins), dsp (31 pins), usb (11 pins)
NetC5_2: converter (C5.2 R7.2), dsp (D4.11 D4.17)
NetC6_2: converter (C6.2 R8.1), dsp (D4.12)
NetC11_1: converter (C11.1 R17.2), dsp (D4.18)
NetC16_2: converter (C16.2 R21.2), dsp (D4.10)
NetD2_6: converter (D2.6 R12.2), dsp (D4.31)
NetD2_7: converter (D2.7 R14.2), dsp (D4.30)
NetD2_8: converter (D2.8 R13.2), dsp (D4.29)
NetD4_42: dsp (D4.42), usb (D5.25 VD8.2)
NetD4_43: dsp (D4.43), usb (D5.26 VD9.2)